# Altium schematic sheet InfoDisplayLEDs.SchDoc
size A
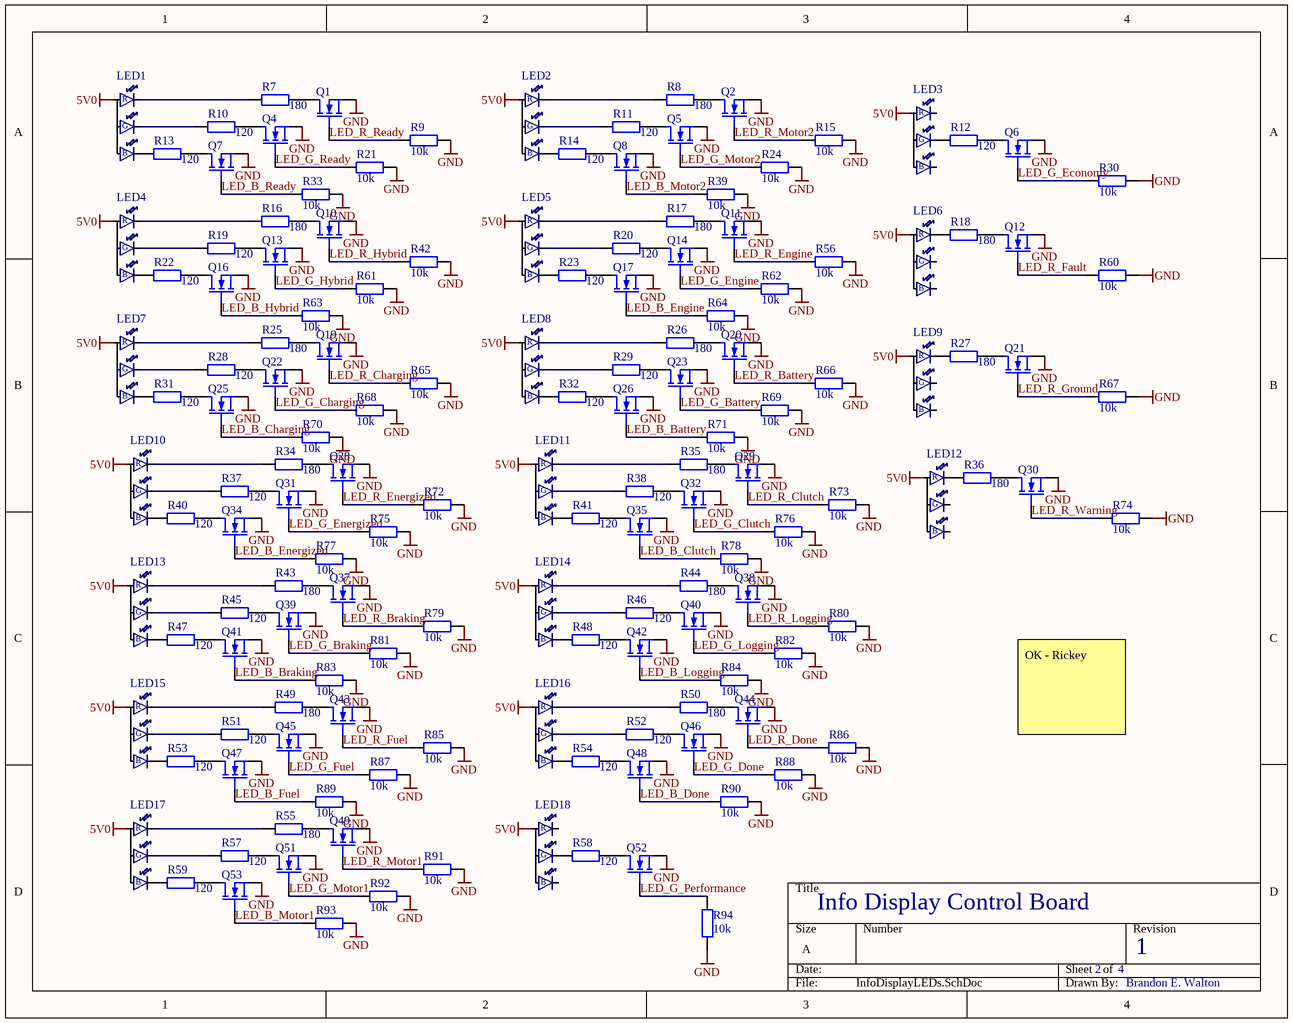
[diagram p0: InfoDisplayLEDs.SchDoc]

## Parts
LED1  LED  [CLVBA-FKA-CAEDH8BBB7A363CT-ND]  (value not drawn)
LED2  LED  [CLVBA-FKA-CAEDH8BBB7A363CT-ND]  (value not drawn)
LED3  LED  [CLVBA-FKA-CAEDH8BBB7A363CT-ND]  (value not drawn)
LED4  LED  [CLVBA-FKA-CAEDH8BBB7A363CT-ND]  (value not drawn)
LED5  LED  [CLVBA-FKA-CAEDH8BBB7A363CT-ND]  (value not drawn)
LED6  LED  [CLVBA-FKA-CAEDH8BBB7A363CT-ND]  (value not drawn)
LED7  LED  [CLVBA-FKA-CAEDH8BBB7A363CT-ND]  (value not drawn)
LED8  LED  [CLVBA-FKA-CAEDH8BBB7A363CT-ND]  (value not drawn)
LED9  LED  [CLVBA-FKA-CAEDH8BBB7A363CT-ND]  (value not drawn)
LED10  LED  [CLVBA-FKA-CAEDH8BBB7A363CT-ND]  (value not drawn)
LED11  LED  [CLVBA-FKA-CAEDH8BBB7A363CT-ND]  (value not drawn)
LED12  LED  [CLVBA-FKA-CAEDH8BBB7A363CT-ND]  (value not drawn)
LED13  LED  [CLVBA-FKA-CAEDH8BBB7A363CT-ND]  (value not drawn)
LED14  LED  [CLVBA-FKA-CAEDH8BBB7A363CT-ND]  (value not drawn)
LED15  LED  [CLVBA-FKA-CAEDH8BBB7A363CT-ND]  (value not drawn)
LED16  LED  [CLVBA-FKA-CAEDH8BBB7A363CT-ND]  (value not drawn)
LED17  LED  [CLVBA-FKA-CAEDH8BBB7A363CT-ND]  (value not drawn)
LED18  LED  [CLVBA-FKA-CAEDH8BBB7A363CT-ND]  (value not drawn)
Q1  MOSFET-N  [SOT50P160X110-3N]  (value not drawn)
Q2  MOSFET-N  [SOT50P160X110-3N]  (value not drawn)
Q4  MOSFET-N  [SOT50P160X110-3N]  (value not drawn)
Q5  MOSFET-N  [SOT50P160X110-3N]  (value not drawn)
Q6  MOSFET-N  [SOT50P160X110-3N]  (value not drawn)
Q7  MOSFET-N  [SOT50P160X110-3N]  (value not drawn)
Q8  MOSFET-N  [SOT50P160X110-3N]  (value not drawn)
Q10  MOSFET-N  [SOT50P160X110-3N]  (value not drawn)
Q11  MOSFET-N  [SOT50P160X110-3N]  (value not drawn)
Q12  MOSFET-N  [SOT50P160X110-3N]  (value not drawn)
Q13  MOSFET-N  [SOT50P160X110-3N]  (value not drawn)
Q14  MOSFET-N  [SOT50P160X110-3N]  (value not drawn)
Q16  MOSFET-N  [SOT50P160X110-3N]  (value not drawn)
Q17  MOSFET-N  [SOT50P160X110-3N]  (value not drawn)
Q19  MOSFET-N  [SOT50P160X110-3N]  (value not drawn)
Q20  MOSFET-N  [SOT50P160X110-3N]  (value not drawn)
Q21  MOSFET-N  [SOT50P160X110-3N]  (value not drawn)
Q22  MOSFET-N  [SOT50P160X110-3N]  (value not drawn)
Q23  MOSFET-N  [SOT50P160X110-3N]  (value not drawn)
Q25  MOSFET-N  [SOT50P160X110-3N]  (value not drawn)
Q26  MOSFET-N  [SOT50P160X110-3N]  (value not drawn)
Q28  MOSFET-N  [SOT50P160X110-3N]  (value not drawn)
Q29  MOSFET-N  [SOT50P160X110-3N]  (value not drawn)
Q30  MOSFET-N  [SOT50P160X110-3N]  (value not drawn)
Q31  MOSFET-N  [SOT50P160X110-3N]  (value not drawn)
Q32  MOSFET-N  [SOT50P160X110-3N]  (value not drawn)
Q34  MOSFET-N  [SOT50P160X110-3N]  (value not drawn)
Q35  MOSFET-N  [SOT50P160X110-3N]  (value not drawn)
Q37  MOSFET-N  [SOT50P160X110-3N]  (value not drawn)
Q38  MOSFET-N  [SOT50P160X110-3N]  (value not drawn)
Q39  MOSFET-N  [SOT50P160X110-3N]  (value not drawn)
Q40  MOSFET-N  [SOT50P160X110-3N]  (value not drawn)
Q41  MOSFET-N  [SOT50P160X110-3N]  (value not drawn)
Q42  MOSFET-N  [SOT50P160X110-3N]  (value not drawn)
Q43  MOSFET-N  [SOT50P160X110-3N]  (value not drawn)
Q44  MOSFET-N  [SOT50P160X110-3N]  (value not drawn)
Q45  MOSFET-N  [SOT50P160X110-3N]  (value not drawn)
Q46  MOSFET-N  [SOT50P160X110-3N]  (value not drawn)
Q47  MOSFET-N  [SOT50P160X110-3N]  (value not drawn)
Q48  MOSFET-N  [SOT50P160X110-3N]  (value not drawn)
Q49  MOSFET-N  [SOT50P160X110-3N]  (value not drawn)
Q51  MOSFET-N  [SOT50P160X110-3N]  (value not drawn)
Q52  MOSFET-N  [SOT50P160X110-3N]  (value not drawn)
Q53  MOSFET-N  [SOT50P160X110-3N]  (value not drawn)
R7  value 180  [1608[0603]]  (hidden comment: Res2)
R8  value 180  [1608[0603]]  (hidden comment: Res2)
R9  value 10k  [1608[0603]]  (hidden comment: 311-10KGRCT-ND)
R10  value 120  [1608[0603]]  (hidden comment: Res2)
R11  value 120  [1608[0603]]  (hidden comment: Res2)
R12  value 120  [1608[0603]]  (hidden comment: Res2)
R13  value 120  [1608[0603]]  (hidden comment: Res2)
R14  value 120  [1608[0603]]  (hidden comment: Res2)
R15  value 10k  [1608[0603]]  (hidden comment: 311-10KGRCT-ND)
R16  value 180  [1608[0603]]  (hidden comment: Res2)
R17  value 180  [1608[0603]]  (hidden comment: Res2)
R18  value 180  [1608[0603]]  (hidden comment: Res2)
R19  value 120  [1608[0603]]  (hidden comment: Res2)
R20  value 120  [1608[0603]]  (hidden comment: Res2)
R21  value 10k  [1608[0603]]  (hidden comment: 311-10KGRCT-ND)
R22  value 120  [1608[0603]]  (hidden comment: Res2)
R23  value 120  [1608[0603]]  (hidden comment: Res2)
R24  value 10k  [1608[0603]]  (hidden comment: 311-10KGRCT-ND)
R25  value 180  [1608[0603]]  (hidden comment: Res2)
R26  value 180  [1608[0603]]  (hidden comment: Res2)
R27  value 180  [1608[0603]]  (hidden comment: Res2)
R28  value 120  [1608[0603]]  (hidden comment: Res2)
R29  value 120  [1608[0603]]  (hidden comment: Res2)
R30  value 10k  [1608[0603]]  (hidden comment: 311-10KGRCT-ND)
R31  value 120  [1608[0603]]  (hidden comment: Res2)
R32  value 120  [1608[0603]]  (hidden comment: Res2)
R33  value 10k  [1608[0603]]  (hidden comment: 311-10KGRCT-ND)
R34  value 180  [1608[0603]]  (hidden comment: Res2)
R35  value 180  [1608[0603]]  (hidden comment: Res2)
R36  value 180  [1608[0603]]  (hidden comment: Res2)
R37  value 120  [1608[0603]]  (hidden comment: Res2)
R38  value 120  [1608[0603]]  (hidden comment: Res2)
R39  value 10k  [1608[0603]]  (hidden comment: 311-10KGRCT-ND)
R40  value 120  [1608[0603]]  (hidden comment: Res2)
R41  value 120  [1608[0603]]  (hidden comment: Res2)
R42  value 10k  [1608[0603]]  (hidden comment: 311-10KGRCT-ND)
R43  value 180  [1608[0603]]  (hidden comment: Res2)
R44  value 180  [1608[0603]]  (hidden comment: Res2)
R45  value 120  [1608[0603]]  (hidden comment: Res2)
R46  value 120  [1608[0603]]  (hidden comment: Res2)
R47  value 120  [1608[0603]]  (hidden comment: Res2)
R48  value 120  [1608[0603]]  (hidden comment: Res2)
R49  value 180  [1608[0603]]  (hidden comment: Res2)
R50  value 180  [1608[0603]]  (hidden comment: Res2)
R51  value 120  [1608[0603]]  (hidden comment: Res2)
R52  value 120  [1608[0603]]  (hidden comment: Res2)
R53  value 120  [1608[0603]]  (hidden comment: Res2)
R54  value 120  [1608[0603]]  (hidden comment: Res2)
R55  value 180  [1608[0603]]  (hidden comment: Res2)
R56  value 10k  [1608[0603]]  (hidden comment: 311-10KGRCT-ND)
R57  value 120  [1608[0603]]  (hidden comment: Res2)
R58  value 120  [1608[0603]]  (hidden comment: Res2)
R59  value 120  [1608[0603]]  (hidden comment: Res2)
R60  value 10k  [1608[0603]]  (hidden comment: 311-10KGRCT-ND)
R61  value 10k  [1608[0603]]  (hidden comment: 311-10KGRCT-ND)
R62  value 10k  [1608[0603]]  (hidden comment: 311-10KGRCT-ND)
R63  value 10k  [1608[0603]]  (hidden comment: 311-10KGRCT-ND)
R64  value 10k  [1608[0603]]  (hidden comment: 311-10KGRCT-ND)
R65  value 10k  [1608[0603]]  (hidden comment: 311-10KGRCT-ND)
R66  value 10k  [1608[0603]]  (hidden comment: 311-10KGRCT-ND)
R67  value 10k  [1608[0603]]  (hidden comment: 311-10KGRCT-ND)
R68  value 10k  [1608[0603]]  (hidden comment: 311-10KGRCT-ND)
R69  value 10k  [1608[0603]]  (hidden comment: 311-10KGRCT-ND)
R70  value 10k  [1608[0603]]  (hidden comment: 311-10KGRCT-ND)
R71  value 10k  [1608[0603]]  (hidden comment: 311-10KGRCT-ND)
R72  value 10k  [1608[0603]]  (hidden comment: 311-10KGRCT-ND)
R73  value 10k  [1608[0603]]  (hidden comment: 311-10KGRCT-ND)
R74  value 10k  [1608[0603]]  (hidden comment: 311-10KGRCT-ND)
R75  value 10k  [1608[0603]]  (hidden comment: 311-10KGRCT-ND)
R76  value 10k  [1608[0603]]  (hidden comment: 311-10KGRCT-ND)
R77  value 10k  [1608[0603]]  (hidden comment: 311-10KGRCT-ND)
R78  value 10k  [1608[0603]]  (hidden comment: 311-10KGRCT-ND)
R79  value 10k  [1608[0603]]  (hidden comment: 311-10KGRCT-ND)
R80  value 10k  [1608[0603]]  (hidden comment: 311-10KGRCT-ND)
R81  value 10k  [1608[0603]]  (hidden comment: 311-10KGRCT-ND)
R82  value 10k  [1608[0603]]  (hidden comment: 311-10KGRCT-ND)
R83  value 10k  [1608[0603]]  (hidden comment: 311-10KGRCT-ND)
R84  value 10k  [1608[0603]]  (hidden comment: 311-10KGRCT-ND)
R85  value 10k  [1608[0603]]  (hidden comment: 311-10KGRCT-ND)
R86  value 10k  [1608[0603]]  (hidden comment: 311-10KGRCT-ND)
R87  value 10k  [1608[0603]]  (hidden comment: 311-10KGRCT-ND)
R88  value 10k  [1608[0603]]  (hidden comment: 311-10KGRCT-ND)
R89  value 10k  [1608[0603]]  (hidden comment: 311-10KGRCT-ND)
R90  value 10k  [1608[0603]]  (hidden comment: 311-10KGRCT-ND)
R91  value 10k  [1608[0603]]  (hidden comment: 311-10KGRCT-ND)
R92  value 10k  [1608[0603]]  (hidden comment: 311-10KGRCT-ND)
R93  value 10k  [1608[0603]]  (hidden comment: 311-10KGRCT-ND)
R94  value 10k  [1608[0603]]  (hidden comment: 311-10KGRCT-ND)

## Nets
5V0: LED1.2(COMMON) LED2.2(COMMON) LED3.2(COMMON) LED4.2(COMMON) LED5.2(COMMON) LED6.2(COMMON) LED7.2(COMMON) LED8.2(COMMON) LED9.2(COMMON) LED10.2(COMMON) LED11.2(COMMON) LED12.2(COMMON) LED13.2(COMMON) LED14.2(COMMON) LED15.2(COMMON) LED16.2(COMMON) LED17.2(COMMON) LED18.2(COMMON)
GND: Q1.3(S) Q2.3(S) Q4.3(S) Q5.3(S) Q6.3(S) Q7.3(S) Q8.3(S) Q10.3(S) Q11.3(S) Q12.3(S) Q13.3(S) Q14.3(S) Q16.3(S) Q17.3(S) Q19.3(S) Q20.3(S) Q21.3(S) Q22.3(S) Q23.3(S) Q25.3(S) Q26.3(S) Q28.3(S) Q29.3(S) Q30.3(S) Q31.3(S) Q32.3(S) Q34.3(S) Q35.3(S) Q37.3(S) Q38.3(S) Q39.3(S) Q40.3(S) Q41.3(S) Q42.3(S) Q43.3(S) Q44.3(S) Q45.3(S) Q46.3(S) Q47.3(S) Q48.3(S) Q49.3(S) Q51.3(S) Q52.3(S) Q53.3(S) R9.2 R15.2 R21.2 R24.2 R30.1 R33.2 R39.2 R42.2 R56.2 R60.2 R61.2 R62.2 R63.2 R64.2 R65.2 R66.2 R67.2 R68.2 R69.2 R70.2 R71.2 R72.2 R73.2 R74.2 R75.2 R76.2 R77.2 R78.2 R79.2 R80.2 R81.2 R82.2 R83.2 R84.2 R85.2 R86.2 R87.2 R88.2 R89.2 R90.2 R91.2 R92.2 R93.2 R94.1
LED_B_Battery: Q26.2(G) R71.1
LED_B_Braking: Q41.2(G) R83.1
LED_B_Charging: Q25.2(G) R70.1
LED_B_Clutch: Q35.2(G) R78.1
LED_B_Done: Q48.2(G) R90.1
LED_B_Energized: Q34.2(G) R77.1
LED_B_Engine: Q17.2(G) R64.1
LED_B_Fuel: Q47.2(G) R89.1
LED_B_Hybrid: Q16.2(G) R63.1
LED_B_Logging: Q42.2(G) R84.1
LED_B_Motor1: Q53.2(G) R93.1
LED_B_Motor2: Q8.2(G) R39.1
LED_B_Ready: Q7.2(G) R33.1
LED_G_Battery: Q23.2(G) R69.1
LED_G_Braking: Q39.2(G) R81.1
LED_G_Charging: Q22.2(G) R68.1
LED_G_Clutch: Q32.2(G) R76.1
LED_G_Done: Q46.2(G) R88.1
LED_G_Economy: Q6.2(G) R30.2
LED_G_Energized: Q31.2(G) R75.1
LED_G_Engine: Q14.2(G) R62.1
LED_G_Fuel: Q45.2(G) R87.1
LED_G_Hybrid: Q13.2(G) R61.1
LED_G_Logging: Q40.2(G) R82.1
LED_G_Motor1: Q51.2(G) R92.1
LED_G_Motor2: Q5.2(G) R24.1
LED_G_Performance: Q52.2(G) R94.2
LED_G_Ready: Q4.2(G) R21.1
LED_R_Battery: Q20.2(G) R66.1
LED_R_Braking: Q37.2(G) R79.1
LED_R_Charging: Q19.2(G) R65.1
LED_R_Clutch: Q29.2(G) R73.1
LED_R_Done: Q44.2(G) R86.1
LED_R_Energized: Q28.2(G) R72.1
LED_R_Engine: Q11.2(G) R56.1
LED_R_Fault: Q12.2(G) R60.1
LED_R_Fuel: Q43.2(G) R85.1
LED_R_Ground: Q21.2(G) R67.1
LED_R_Hybrid: Q10.2(G) R42.1
LED_R_Logging: Q38.2(G) R80.1
LED_R_Motor1: Q49.2(G) R91.1
LED_R_Motor2: Q2.2(G) R15.1
LED_R_Ready: Q1.2(G) R9.1
LED_R_Warning: Q30.2(G) R74.1
NetLED1_1: LED1.1(RED) R7.2
NetLED1_3: LED1.3(BLUE) R13.2
NetLED1_4: LED1.4(GREEN) R10.2
NetLED2_1: LED2.1(RED) R8.2
NetLED2_3: LED2.3(BLUE) R14.2
NetLED2_4: LED2.4(GREEN) R11.2
NetLED3_4: LED3.4(GREEN) R12.2
NetLED4_1: LED4.1(RED) R16.2
NetLED4_3: LED4.3(BLUE) R22.2
NetLED4_4: LED4.4(GREEN) R19.2
NetLED5_1: LED5.1(RED) R17.2
NetLED5_3: LED5.3(BLUE) R23.2
NetLED5_4: LED5.4(GREEN) R20.2
NetLED6_1: LED6.1(RED) R18.2
NetLED7_1: LED7.1(RED) R25.2
NetLED7_3: LED7.3(BLUE) R31.2
NetLED7_4: LED7.4(GREEN) R28.2
NetLED8_1: LED8.1(RED) R26.2
NetLED8_3: LED8.3(BLUE) R32.2
NetLED8_4: LED8.4(GREEN) R29.2
NetLED9_1: LED9.1(RED) R27.2
NetLED10_1: LED10.1(RED) R34.2
NetLED10_3: LED10.3(BLUE) R40.2
NetLED10_4: LED10.4(GREEN) R37.2
NetLED11_1: LED11.1(RED) R35.2
NetLED11_3: LED11.3(BLUE) R41.2
NetLED11_4: LED11.4(GREEN) R38.2
NetLED12_1: LED12.1(RED) R36.2
NetLED13_1: LED13.1(RED) R43.2
NetLED13_3: LED13.3(BLUE) R47.2
NetLED13_4: LED13.4(GREEN) R45.2
NetLED14_1: LED14.1(RED) R44.2
NetLED14_3: LED14.3(BLUE) R48.2
NetLED14_4: LED14.4(GREEN) R46.2
NetLED15_1: LED15.1(RED) R49.2
NetLED15_3: LED15.3(BLUE) R53.2
NetLED15_4: LED15.4(GREEN) R51.2
NetLED16_1: LED16.1(RED) R50.2
NetLED16_3: LED16.3(BLUE) R54.2
NetLED16_4: LED16.4(GREEN) R52.2
NetLED17_1: LED17.1(RED) R55.2
NetLED17_3: LED17.3(BLUE) R59.2
NetLED17_4: LED17.4(GREEN) R57.2
NetLED18_4: LED18.4(GREEN) R58.2
NetQ1_1: Q1.1(D) R7.1
NetQ2_1: Q2.1(D) R8.1
NetQ4_1: Q4.1(D) R10.1
NetQ5_1: Q5.1(D) R11.1
NetQ6_1: Q6.1(D) R12.1
NetQ7_1: Q7.1(D) R13.1
NetQ8_1: Q8.1(D) R14.1
NetQ10_1: Q10.1(D) R16.1
NetQ11_1: Q11.1(D) R17.1
NetQ12_1: Q12.1(D) R18.1
NetQ13_1: Q13.1(D) R19.1
NetQ14_1: Q14.1(D) R20.1
NetQ16_1: Q16.1(D) R22.1
NetQ17_1: Q17.1(D) R23.1
NetQ19_1: Q19.1(D) R25.1
NetQ20_1: Q20.1(D) R26.1
NetQ21_1: Q21.1(D) R27.1
NetQ22_1: Q22.1(D) R28.1
NetQ23_1: Q23.1(D) R29.1
NetQ25_1: Q25.1(D) R31.1
NetQ26_1: Q26.1(D) R32.1
NetQ28_1: Q28.1(D) R34.1
NetQ29_1: Q29.1(D) R35.1
NetQ30_1: Q30.1(D) R36.1
NetQ31_1: Q31.1(D) R37.1
NetQ32_1: Q32.1(D) R38.1
NetQ34_1: Q34.1(D) R40.1
NetQ35_1: Q35.1(D) R41.1
NetQ37_1: Q37.1(D) R43.1
NetQ38_1: Q38.1(D) R44.1
NetQ39_1: Q39.1(D) R45.1
NetQ40_1: Q40.1(D) R46.1
NetQ41_1: Q41.1(D) R47.1
NetQ42_1: Q42.1(D) R48.1
NetQ43_1: Q43.1(D) R49.1
NetQ44_1: Q44.1(D) R50.1
NetQ45_1: Q45.1(D) R51.1
NetQ46_1: Q46.1(D) R52.1
NetQ47_1: Q47.1(D) R53.1
NetQ48_1: Q48.1(D) R54.1
NetQ49_1: Q49.1(D) R55.1
NetQ51_1: Q51.1(D) R57.1
NetQ52_1: Q52.1(D) R58.1
NetQ53_1: Q53.1(D) R59.1

Not connected (* = marked no-connect by the designer): LED3 1(RED) 3(BLUE); LED6 3(BLUE) 4(GREEN); LED9 3(BLUE) 4(GREEN); LED12 3(BLUE) 4(GREEN); LED18 1(RED) 3(BLUE)

## Notes on the sheet
- OK - Rickey
- Info Display Control Board
- 2
- 4
- 1
- Brandon E. Walton
- (in symbol LED) R; G; B

## Library data of the parts
LED1 = LED: LED RGB; PartNumber: CLVBA-FKA-CAEDH8BBB7A363; Digikey: CLVBA-FKA-CAEDH8BBB7A363CT-ND
Q1 Q2 Q4-Q8 Q10-Q14 Q16 Q17 Q19-Q23 Q25 Q26 Q28-Q31 Q34 Q35 Q37-Q49 Q51-Q53 = MOSFET-N: N-Channel MOSFET; Published: 8-Jun-2000; LatestRevisionDate: 17-Jul-2002; LatestRevisionNote: Re-released for DXP Platform.; PackageVersion: 1995/1996; PackageReference: E3; Publisher: Altium Limited; PackageDescription: TO, Flat Index; 3 In-Line, Axial Leads; Body Dia. 4.6mm; Lead Dia. 0.5 mm (max); Digikey: SSM3K15AFSLFCT-ND
Q32 = MOSFET-N: N-Channel MOSFET; PartNumber: SSM3K15AFS,LF; Published: 8-Jun-2000; LatestRevisionDate: 17-Jul-2002; LatestRevisionNote: Re-released for DXP Platform.; PackageVersion: 1995/1996; PackageReference: E3; Publisher: Altium Limited; PackageDescription: TO, Flat Index; 3 In-Line, Axial Leads; Body Dia. 4.6mm; Lead Dia. 0.5 mm (max); Digikey: SSM3K15AFSLFCT-ND
R7-R34 R36-R40 R42-R94 = Res2: Resistor; Published: 8-Jun-2000; LatestRevisionDate: 17-Jul-2002; LatestRevisionNote: Re-released for DXP Platform.; PackageReference: AXIAL-0.4; Publisher: Altium Limited; PackageDescription: Axial Device, Thru-Hole; 2 Leads; 0.4 in Pin Spacing
  R7 R8 R16-R18 R25-R27 R34 R36 R43 R44 R49 R50 R55: Digikey: RNCP0603FTD180RCT-ND
  R9 R15 R21 R24 R30 R33 R39 R42 R56 R60-R94: Digikey: 311-10KGRCT-ND
  R10-R14 R19 R20 R22 R23 R28 R29 R31 R32 R37 R38 R40 R45-R48 R51-R54 R57-R59: Digikey: 311-120GRCT-ND
R35 = Res2: Resistor; PartNumber: ESR03EZPJ101; Published: 8-Jun-2000; LatestRevisionDate: 17-Jul-2002; LatestRevisionNote: Re-released for DXP Platform.; PackageReference: AXIAL-0.4; Publisher: Altium Limited; PackageDescription: Axial Device, Thru-Hole; 2 Leads; 0.4 in Pin Spacing; Digikey: RNCP0603FTD180RCT-ND
R41 = Res2: Resistor; PartNumber: CRCW120622R0JNEA; Published: 8-Jun-2000; LatestRevisionDate: 17-Jul-2002; LatestRevisionNote: Re-released for DXP Platform.; PackageReference: AXIAL-0.4; Publisher: Altium Limited; PackageDescription: Axial Device, Thru-Hole; 2 Leads; 0.4 in Pin Spacing; Digikey: 311-120GRCT-ND
LED2-LED18 = LED: Digikey: CLVBA-FKA-CAEDH8BBB7A363CT-ND